# Altium schematic sheet Sheet1.SchDoc: 8SoundsUSB-MIC
size Tabloid; Date: 2011-12-05; CheckedBy: Checked by : S.Choquette; Author: M.Bandou; Revision: 3.0.2; SheetNumber: 1; SheetTotal: 1; SheetName: Electret microphone + diff. amp.
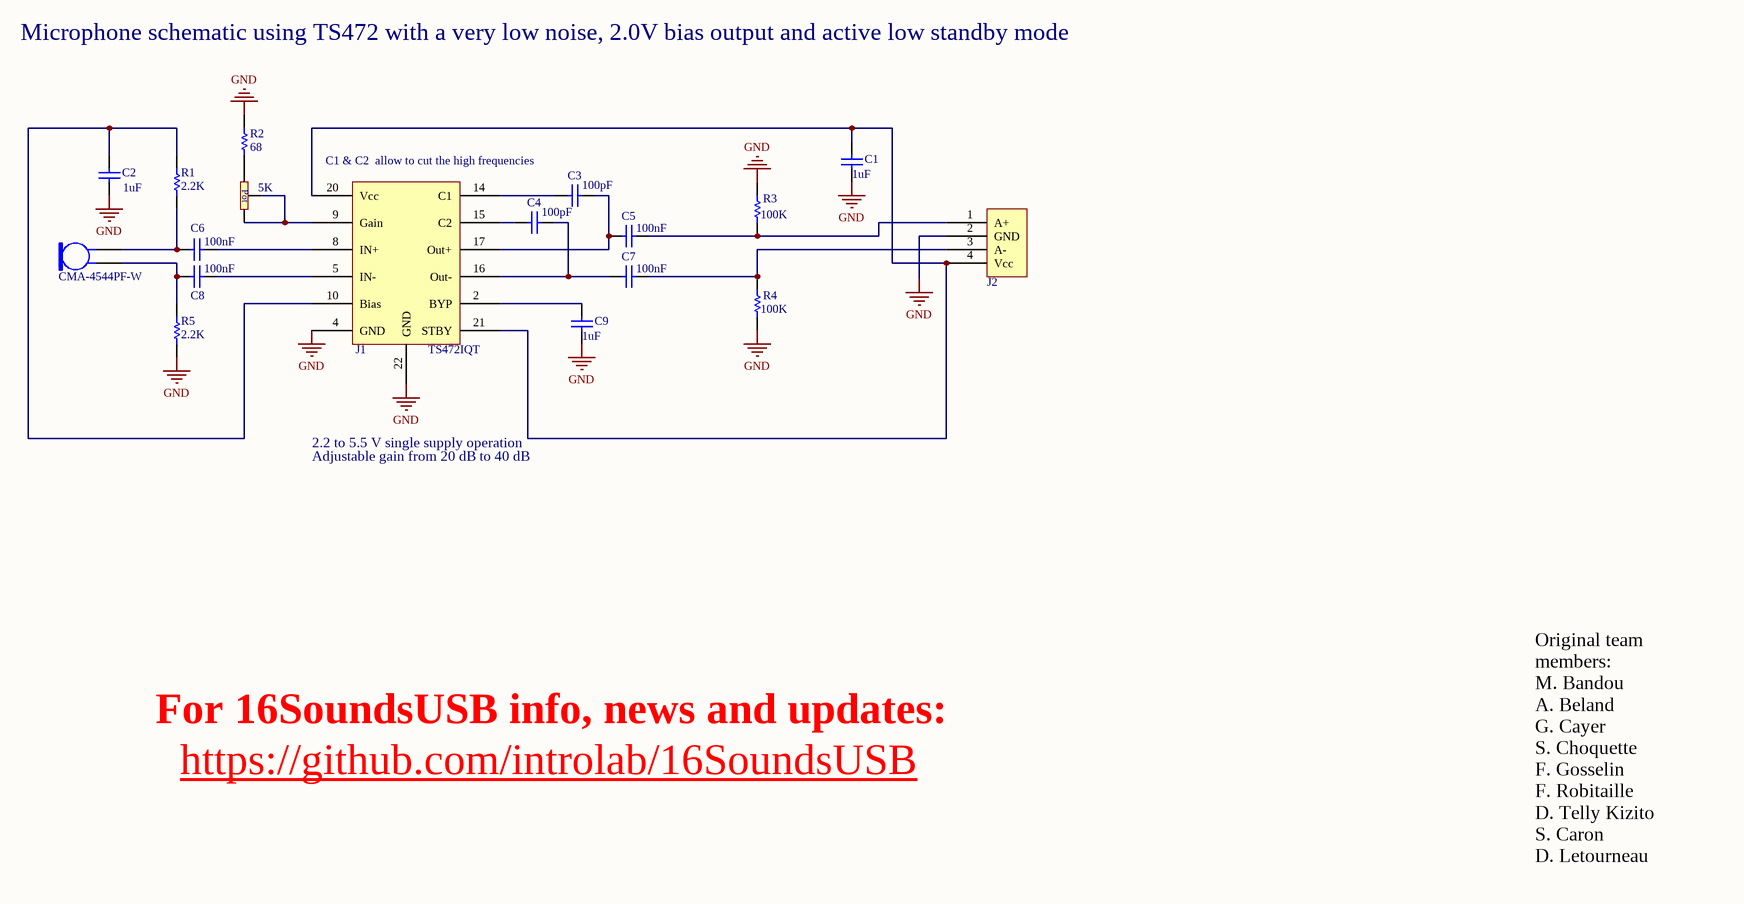
[diagram p0: Sheet1.SchDoc]

## Parts
C1  1uF  [C0603]
C2  1uF  [C0603]
C3  100pF  [C0603]
C4  100pF  [C0603]
C5  100nF  [C0603]
C6  100nF  [C0603]
C7  100nF  [C0603]
C8  100nF  [C0603]
C9  1uF  [C0603]
J1  TS472IQT  [TS472]
J2  95503-6651  [RJ11 Micro]  (value not drawn)
MK1  CMA-4544PF-W  [Mic]
pot  value 5K  [CT-94]  (hidden comment: CT94EW502)
R1  2.2k  [R0603]
R2  68  [R0603]
R3  100K  [R0603]
R4  100K  [R0603]
R5  2.2K  [R0603]

## Nets
GND: C1.2 C2.2 C9.2 J1.4(GND) J1.22(GND) J2.2(GND) R2.1 R3.2 R4.2 R5.2
NetC1_1: C1.1 J1.20(Vcc) J1.21(STBY) J2.4(Vcc)
NetC2_1: C2.1 J1.10(Bias) R1.1
NetC3_1: C3.1 J1.14(C1)
NetC3_2: C3.2 C5.1 J1.17(Out+)
NetC4_1: C4.1 J1.15(C2)
NetC4_2: C4.2 C7.1 J1.16(Out-)
NetC5_2: C5.2 J2.1(A+) R3.1
NetC6_1: C6.1 MK1.2 R1.2
NetC6_2: C6.2 J1.8(IN+)
NetC7_2: C7.2 J2.3(A-) R4.1
NetC8_1: C8.1 MK1.1 R5.1
NetC8_2: C8.2 J1.5(IN-)
NetC9_1: C9.1 J1.2(BYP)
NetJ1_9: J1.9(Gain) pot.2 pot.3
Netpot_1: pot.1 R2.2

## Notes on the sheet
- Microphone schematic using TS472 with a very low noise, 2.0V bias output and active low standby mode
- C1 & C2  allow to cut the high frequencies
- Adjustable gain from 20 dB to 40 dB
- 2.2 to 5.5 V single supply operation
- For 16SoundsUSB info, news and updates:
- https://github.com/introlab/16SoundsUSB
- Original team members:
  M. Bandou
  A. Beland
  G. Cayer
  S. Choquette
  F. Gosselin
  F. Robitaille
  D. Telly Kizito
  S. Caron
  D. Letourneau
- Sheet name
- http://creativecommons.org
- Project name
- Contact
- Rev
- Date
- Sheet
- of
- (in symbol CT-94) Pot

## Library data of the parts
C1 C2 C9 = Cap: Capacitor; Mfg_PN: GRM188R61A105KA61D; Mfg: Murata Electronics North America; Value: 1uF; Supplier1: Digikey; Supplier1_PN: 490-1543-1-ND
C3 C4 = Cap: Capacitor; Mfg_PN: 0603YC101KAT2A; Mfg: AVX Corporation; Value: 100pF; Supplier1: Digikey; Supplier1_PN: 478-6207-1-ND
C5-C8 = Cap: Capacitor; Mfg_PN: C0603C104K8RACTU; Mfg: Kemet; Value: 100nF; Supplier1: Digikey; Supplier1_PN: 399-1095-1-ND
J1 = TS472: IC Preamp Audio Mono AB 24QFN; Mfg: STMicroelectronics; Mfg_PN: TS472IQT; Supplier1: Digikey; Supplier1_PN: 497-5826-1-ND
J2 = RJ-11-MIC: Conn Jack 6P4C vert. unshielded; Mfg: Molex Connector Corporation; Mfg_PN: 95503-6651; Supplier1: Digikey; Supplier1_PN: WM5584-ND
MK1 = Mic2: Microphone; Mfg: CUI Inc; Mfg_PN: CMA-4544PF-W; Supplier1: Digikey; Supplier1_PN: 102-1721-ND
pot = CT-94: Trimmer Pot 5k Ohms 18 turns; Mfg: Copal Electronics Inc; Mfg_PN: CT94EW502; Supplier1: Digikey; Supplier1_PN: CT94EW502-ND
R1 R5 = Res1: Resistor 1%; Mfg_PN: RC0603JR-072K2L; Mfg: Yageo; Value: 2.2K; Supplier1: Digikey; Supplier1_PN: 311-2.2KGRCT-ND
R2 = Res1: Resistor 1%; Mfg_PN: RC0603JR-0768RL; Mfg: Yageo; Value: 68; Supplier1: Digikey; Supplier1_PN: 311-68GRCT-ND
R3 R4 = Res1: Resistor 1%; Mfg_PN: RC0603JR-07100KL; Mfg: Yageo; Value: 100K; Supplier1: Digikey; Supplier1_PN: 311-100KGRCT-ND